# Altium schematic sheet Bop_It.SchDoc
size A; SheetNumber: 1; SheetTotal: 1
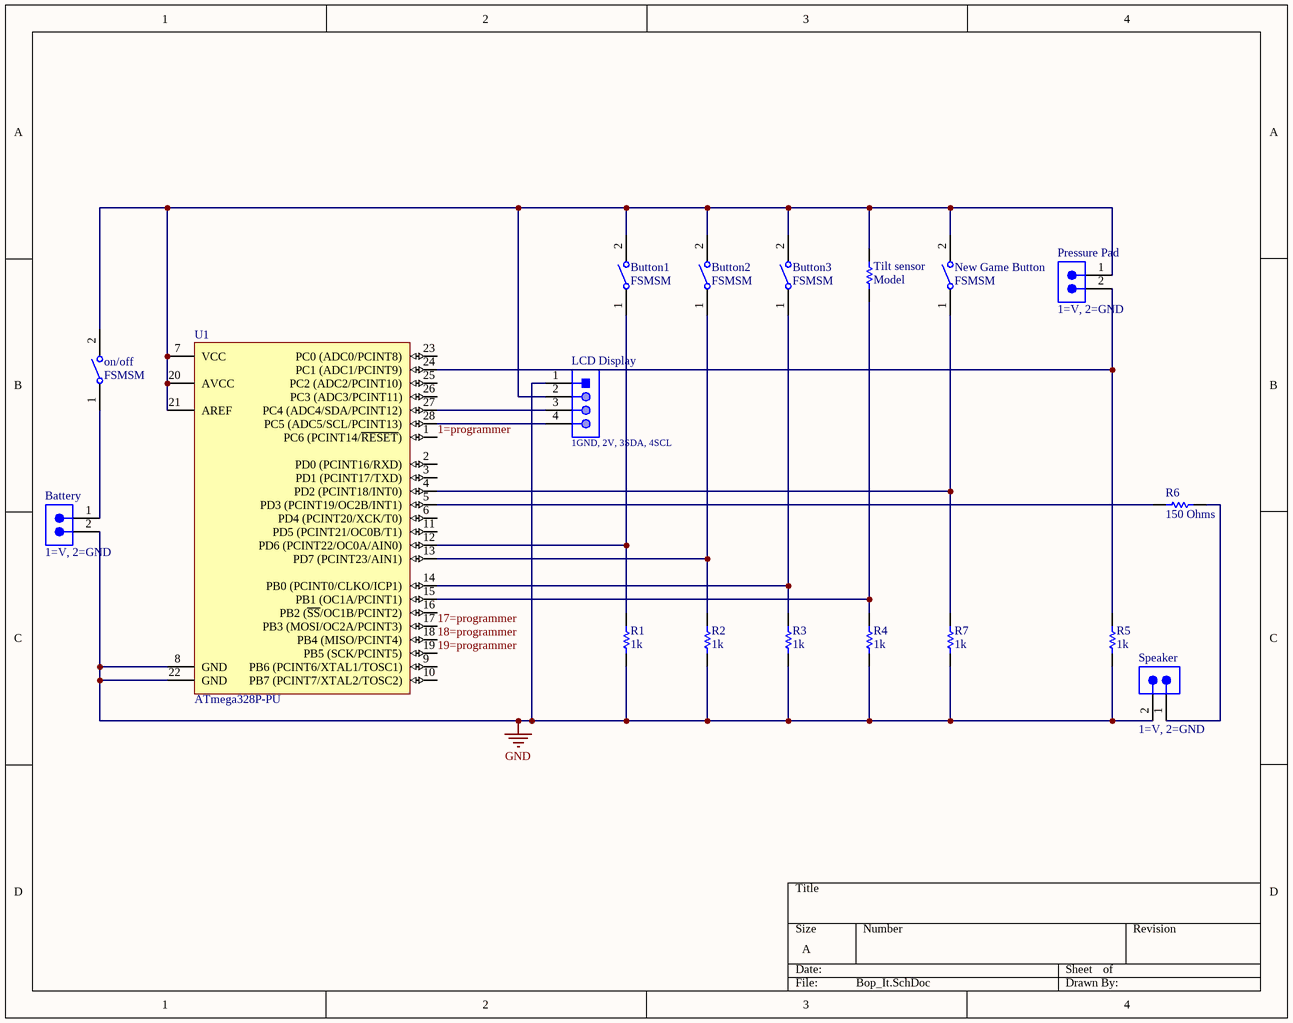
[diagram p0: Bop_It.SchDoc]

## Parts
Battery  1=V, 2=GND  [SMTC-TSW-102-26-XX-S]
Button1  FSMSM  [TECO-FSMSM-2_V]
Button2  FSMSM  [TECO-FSMSM-2_V]
Button3  FSMSM  [TECO-FSMSM-2_V]
LCD_Display  1GND, 2V, 3SDA, 4SCL  [620304124022]
New_Game_Button  FSMSM  [TECO-FSMSM-2_V]
on/off  FSMSM  [TECO-FSMSM-2_V]
Pressure_Pad  1=V, 2=GND  [SMTC-TSW-102-26-XX-S]
R1  1k  [RESA60-630X240]
R2  1k  [RESA60-630X240]
R3  1k  [RESA60-630X240]
R4  1k  [RESA60-630X240]
R5  1k  [RESA60-630X240]
R6  150 Ohms  [RESA60-630X240]
R7  1k  [RESA60-630X240]
Speaker  1=V, 2=GND  [SMTC-TSW-102-26-XX-S]
Tilt_sensor  Model  [RESA60-630X240]
U1  ATmega328P-PU  [28P3]

## Nets
GND: Battery.2 LCD_Display.1 R1.1 R2.1 R3.1 R4.1 R5.1 R7.1 Speaker.2 U1.8(GND) U1.22(GND)
1=programmer: U1.1(PC6_(PCINT14/~{RESET}))
17=programmer: U1.17(PB3_(MOSI/OC2A/PCINT3))
18=programmer: U1.18(PB4_(MISO/PCINT4))
19=programmer: U1.19(PB5_(SCK/PCINT5))
NetBattery_1: Battery.1 on/off.1
NetButton1_1: Button1.1 R1.2 U1.12(PD6_(PCINT22/OC0A/AIN0))
NetButton1_2: Button1.2 Button2.2 Button3.2 LCD_Display.2 New_Game_Button.2 on/off.2 Pressure_Pad.1 Tilt_sensor.2 U1.7(VCC) U1.20(AVCC) U1.21(AREF)
NetButton2_1: Button2.1 R2.2 U1.13(PD7_(PCINT23/AIN1))
NetButton3_1: Button3.1 R3.2 U1.14(PB0_(PCINT0/CLKO/ICP1))
NetLCD_Display_3: LCD_Display.3 U1.27(PC4_(ADC4/SDA/PCINT12))
NetLCD_Display_4: LCD_Display.4 U1.28(PC5_(ADC5/SCL/PCINT13))
NetNew_Game_Button_1: New_Game_Button.1 R7.2 U1.4(PD2_(PCINT18/INT0))
NetPressure_Pad_2: Pressure_Pad.2 R5.2 U1.24(PC1_(ADC1/PCINT9))
NetR4_2: R4.2 Tilt_sensor.1 U1.15(PB1_(OC1A/PCINT1))
NetR6_1: R6.1 Speaker.1
NetR6_2: R6.2 U1.5(PD3_(PCINT19/OC2B/INT1))

Not connected (* = marked no-connect by the designer): U1 2(PD0_(PCINT16/RXD)) 3(PD1_(PCINT17/TXD)) 6(PD4_(PCINT20/XCK/T0)) 9(PB6_(PCINT6/XTAL1/TOSC1)) 10(PB7_(PCINT7/XTAL2/TOSC2)) 11(PD5_(PCINT21/OC0B/T1)) 16(PB2_(~{SS}/OC1B/PCINT2)) 23(PC0_(ADC0/PCINT8)) 25(PC2_(ADC2/PCINT10)) 26(PC3_(ADC3/PCINT11))

## Library data of the parts
Battery Pressure_Pad Speaker = CMP-1024-00329-1: 0.025" SQ Post Header, Through-hole, Vertical, -55 to 125 degC, 2.54 mm Pitch, 2-Pin, Male, RoHS; PartNumber: TSW-102-26-F-S; Manufacturer: Samtec; Pitch: 2.54 mm; PackageVersion: DM, 8/1988; ComponentLink2Description: Datasheet; PackageReference: TSW-102-26-XX-S; ComponentLink3URL: http://www.samtec.com/documents/webfiles/cpdf/TSW-XXX-XX-XXX-X-XX-XXX-MKT.pdf; ComponentLink2URL: http://www.samtec.com/documents/webfiles/pdf/TSW_TH.PDF; ComponentLink1Description: Manufacturer URL; DatasheetVersion: F-214; RoHS: True; ComponentLink3Description: Package Specification; Temperature Range: -55 to 125 degC; Orientation: Vertical; ComponentLink1URL: http://www.samtec.com; PackageDescription: .025[0.64] SQ. Post Terminal Strip Assembly; Mounting Technology: Through-hole
Button1-Button3 New_Game_Button on/off = CMP-2000-07511-1: FSMSM Push Button Switch, 50 mA, -35 to 85 degC, 2-Pin SMD, RoHS, Bulk; Manufacturer: TE Connectivity; Actuator Length: 1.07mm; Electrical Life: 20000Cycles; Actuator Material: Polyamide; Current Rating: 50mA; Illumination Type: Illuminated; Voltage Rating (DC): 24V; Contact Resistance: 100mOhm; Case\/Package: SMD/SMT; Operating Force: 180gf; Switch Travel: 0.25mm; Max Voltage Rating (DC): 12V; Throw Configuration: SPST; Packaging: LoosePiece; Max Operating Temperature: 85degC; ELV: Compliant; Package Description: 2-Pin Surface Mount Device, Body 6 x 3.5 mm, Pitch 9.19 mm; RoHSCompliant: true; Manufacturer URL: http://www.te.com/; Contact Plating: Silver; Contact Material: Brass; Mounting Technology: SurfaceMount; Contact Current Rating: 50mA; Datasheet Version: Rev. C2, 08/2014; Datasheet URL: http://www.te.com/commerce/DocumentDelivery/DDEController?Action=showdoc&DocId=Customer+Drawing%7F1437566-3%7FC2%7Fpdf%7FEnglish%7FENG_CD_1437566-3_C2_1437566_3_1_c.dwg.pdf%7F1437566-3; Mechanical Life: 20000Cycles; Package Reference: FSMSM; REACH SVHC: Unknown; Orientation: Straight; Min Operating Temperature: -35degC; Lead Free: LeadFree; Termination: GullWing; Package Quantity: 1000; Mount: SurfaceMount
LCD_Display = CMP-1502-00662-1: Male Shrouded Header WR-WTB, SMT, Vertical, pitch 2 mm, 1 x 4 position; Manufacturer: Wurth Elektronik; Working Voltage: 100VAC; Contact Resistance: 20mOhm; Pitch: 2mm; Position: 1x4; Part Number: 620304124022; Orientation: Vertical; Publisher: WurthElektronik; Packaging: TapeandReel; Gender: Male; Mounting Technology: SMT; Operating Temperature: -25to85degC; Manufacturer URL: http://www.we-online.de; Package Reference: 620304124022; Datasheet URL: https://katalog.we-online.de/em/datasheet/6203xx124022.pdf
R1-R7 Tilt_sensor = CMP-1659-00075-1: Axial Resistor, 1 KOhm, +/- 1%, 250 mW, -55 to 155 degC, 2-Pin THD, RoHS, Bulk; Voltage Rating: 250 V; Resistance: 10 kohm; Power Rating: 250 mW; ComponentLink2Description: Datasheet; RoHSCompliant: true; PackageReference: MFR-25; Case\Package: Axial; Max Operating Temperature: 155 degC; DatasheetVersion: Apr-13; Tolerance: 1%; ComponentLink1URL: http://www.yageo.com/; Length: 0.248 inch; ComponentLink2URL: http://www.yageo.com/documents/recent/Yageo%20LR_MFR_2013.pdf; Packaging: Bulk; Package Quantity: 200; PackageDescription: 2-Pin Axial Lead, Dia 2.4 mm, Body Length 6.3 mm; Min Operating Temperature: -55 degC; ComponentLink1Description: Manufacturer URL
U1 = CMP-0095-00013-2: 8-bit AVR Microcontroller, 32KB Flash, 1KB EEPROM, 2KB SRAM, 28-pin PDIP, Industrial Grade (-40°C to 85°C); RevisionNote: DatasheetVersion updated. URLs added.; PackageVersion: revB, Sep-2001; PackageDescription: 28-lead (0.300"/7.62mm Wide) Plastic Dual Inline Package (PDIP); DatasheetVersion: revD, May-2011; ComponentLink1Description: Manufacturer URL; ComponentLink1URL: http://www.atmel.com/; PackageReference: 28P3; ComponentLink2Description: ATmega48A/48PA/88A/88PA/168A/168PA/328/328P Datasheet; ComponentLink3URL: http://www.atmel.com/dyn/resources/prod_documents/8271S.pdf; ComponentLink2URL: http://www.atmel.com/dyn/resources/prod_documents/8271.pdf; ComponentLink3Description: ATmega48A/48PA/88A/88PA/168A/168PA/328/328P Summary